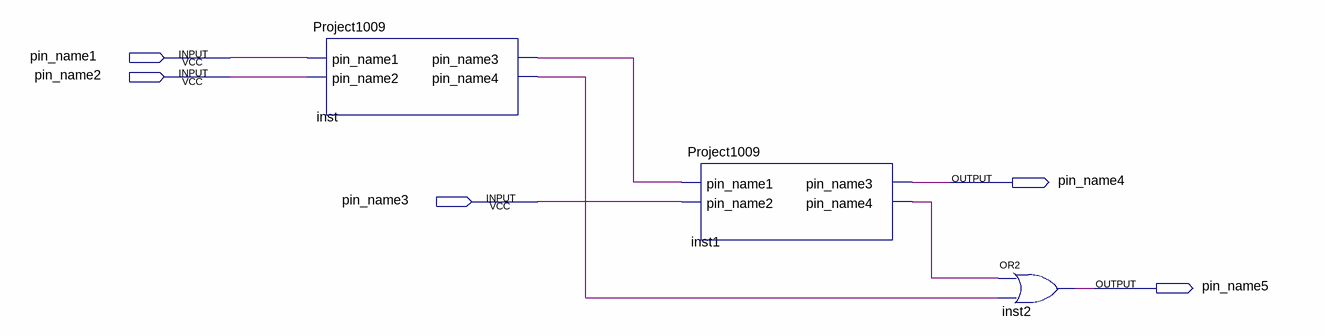
[diagram p0: schematic sheet]
// Quartus schematic FullAdder.bdf as structural Verilog: 3 symbols, 5 pins
module FullAdder (
  input  pin_name1,
  input  pin_name2,
  input  pin_name3,
  output pin_name4,
  output pin_name5
);

  wire inst1_pin_name4, inst_pin_name3, inst_pin_name4;

  Project1009 inst (
    .pin_name1(pin_name1), .pin_name2(pin_name2), .pin_name3(inst_pin_name3), .pin_name4(inst_pin_name4));
  Project1009 inst1 (
    .pin_name1(inst_pin_name3), .pin_name2(pin_name3), .pin_name3(pin_name4), .pin_name4(inst1_pin_name4));
  or inst2 (pin_name5, inst1_pin_name4, inst_pin_name4);
endmodule
